# EAGLE design mirsot_sch-final (EAGLE 9.6.2)
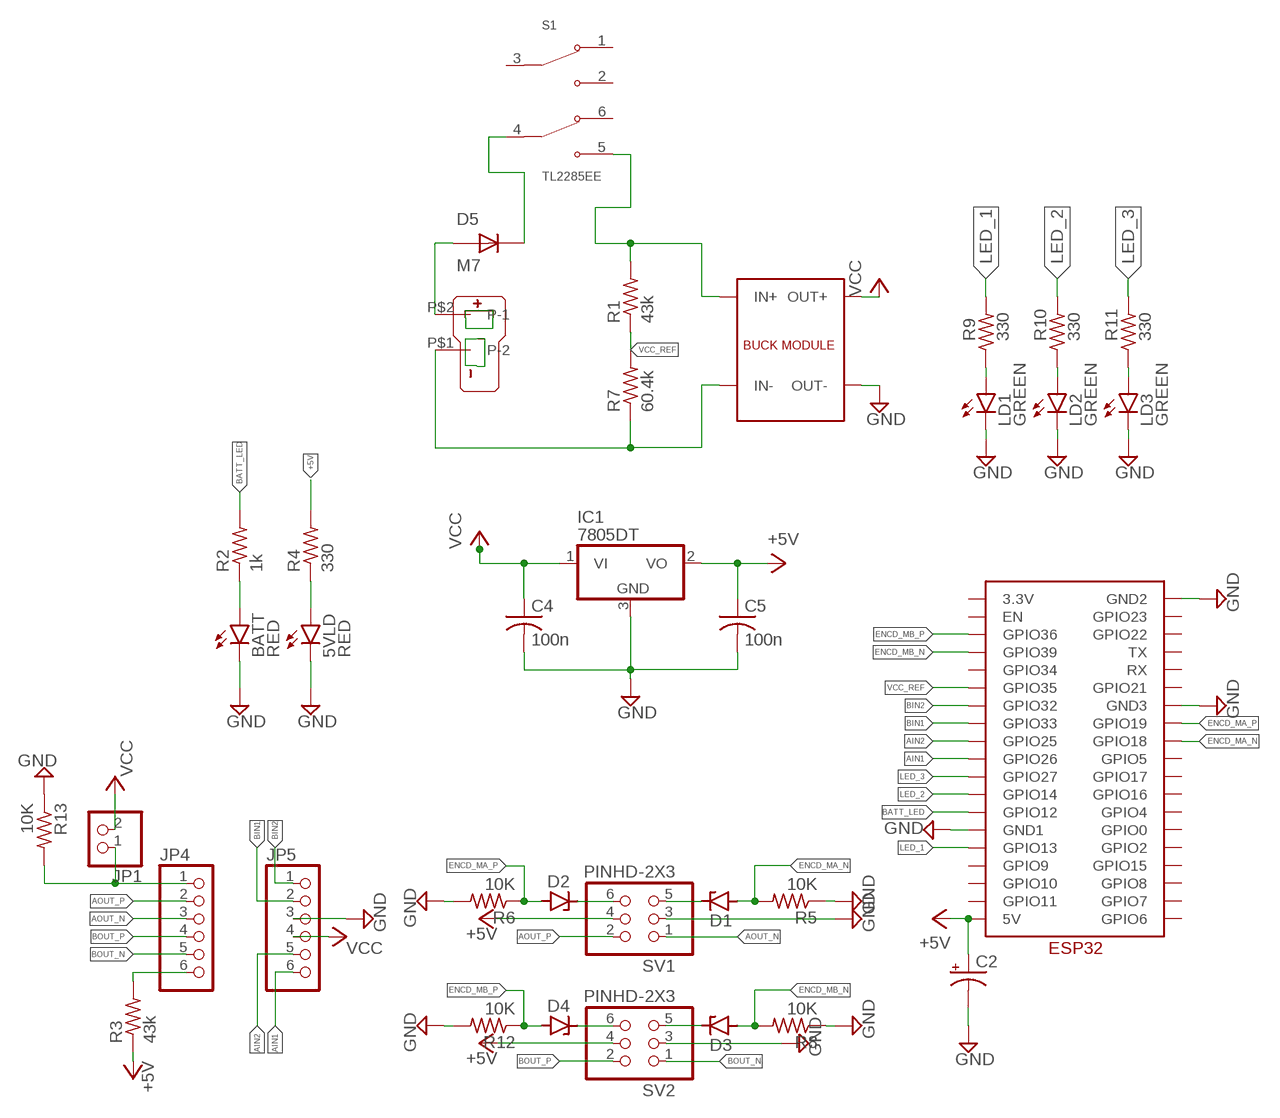
[diagram p0: schematic, sheet 1]

## Parts
5VLD  RED  LEDSML1206  [SML1206]
BATT  RED  LEDSML1206  [SML1206]
C2  CPOL-USE2.5-6  [E2,5-6]
C4  100n  C-USC0603K  [C0603K]
C5  100n  C-USC0603K  [C0603K]
D1  ZENER-DIODEDO34-7  [DO34Z7]
D2  ZENER-DIODEDO34-7  [DO34Z7]
D3  ZENER-DIODEDO34-7  [DO34Z7]
D4  ZENER-DIODEDO34-7  [DO34Z7]
D5  M7  [DIOM505270X240]
IC1  7805DT  [TO252]
JP1  PINHD-1X2  [1X02]
JP4  PINHD-1X6  [1X06]
JP5  PINHD-1X6  [1X06]
LD1  GREEN  LEDSML1206  [SML1206]
LD2  GREEN  LEDSML1206  [SML1206]
LD3  GREEN  LEDSML1206  [SML1206]
R1  43k  R-US_M1206  [M1206]
R2  1k  R-US_M1206  [M1206]
R3  43k  R-US_M1206  [M1206]
R4  330  R-US_M1206  [M1206]
R5  10K  R-US_M1206  [M1206]
R6  10K  R-US_M1206  [M1206]
R7  60.4k  R-US_M1206  [M1206]
R8  10K  R-US_M1206  [M1206]
R9  330  R-US_M1206  [M1206]
R10  330  R-US_M1206  [M1206]
R11  330  R-US_M1206  [M1206]
R12  10K  R-US_M1206  [M1206]
R13  10K  R-US_M1206  [M1206]
S1  TL2285EE  [SW_TL2285EE]
SV1  PINHD-2X3  [2X03]
SV2  PINHD-2X3  [2X03]
U$1  T_PLUG_CONNECTOR_H  [T_PLUG_CONNECTOR_H]
U$2  ESP32  [ESP32]
U$3  BUCK_CONVERTER  [BUCK_CONVERTER]

## Nets
+5V: C2.+ C5.1 IC1.2(VO) R3.1 R4.2 SV1.4 SV2.4 U$2.5V
AIN1 [signal]: JP5.6 U$2.GPIO26
AIN2 [signal]: JP5.5 U$2.GPIO25
AOUT_N: JP4.3 SV1.1
AOUT_P: JP4.2 SV1.2
BATT_LED [signal]: R2.2 U$2.GPIO12
BIN1 [signal]: JP5.2 U$2.GPIO33
BIN2 [signal]: JP5.1 U$2.GPIO32
BOUT_N [power]: JP4.5 SV2.1
BOUT_P [power]: JP4.4 SV2.2
ENCD_MA_N [signal]: D1.A R5.2 U$2.GPIO18
ENCD_MA_P [signal]: D2.A R6.1 U$2.GPIO19
ENCD_MB_N [signal]: D3.A R8.2 U$2.GPIO39
ENCD_MB_P [signal]: D4.A R12.1 U$2.GPIO36
GND [power]: 5VLD.C BATT.C C2.- C4.2 C5.2 IC1.3(GND) JP5.3 LD1.C LD2.C LD3.C R5.1 R6.2 R8.1 R12.2 R13.1 SV1.3 SV2.3 U$2.GND1 U$2.GND2 U$2.GND3 U$3.OUT-
LED_1 [signal]: R9.2 U$2.GPIO13
LED_2 [signal]: R10.2 U$2.GPIO14
LED_3 [signal]: R11.2 U$2.GPIO27
N$1 [signal]: JP4.6 R3.2
N$2 [signal]: BATT.A R2.1
N$3 [signal]: LD1.A R9.1
N$4 [signal]: LD2.A R10.1
N$5 [signal]: 5VLD.A R4.1
N$6: D1.C SV1.5
N$7: D2.C SV1.6
N$8: D3.C SV2.5
N$9 [signal]: LD3.A R11.1
N$10: D4.C SV2.6
N$11 [power]: D5.A U$1.P$2(P-1)
N$13: JP1.1 JP4.1 R13.2
N$14: D5.C S1.4(COM2)
N$15 [power]: R1.2 S1.5(NO2) U$3.IN+
N$16 [power]: R7.1 U$1.P$1(P-2) U$3.IN-
VCC [power]: C4.1 IC1.1(VI) JP1.2 JP5.4 U$3.OUT+
VCC_REF [signal]: R1.1 R7.2 U$2.GPIO35
Unconnected: S1.1(NC1) S1.2(NO1) S1.3(COM1) S1.6(NC2) U$2.3.3V U$2.EN U$2.GPIO0 U$2.GPIO2 U$2.GPIO4 U$2.GPIO5 U$2.GPIO6 U$2.GPIO7 U$2.GPIO8 U$2.GPIO9 U$2.GPIO10 U$2.GPIO11 U$2.GPIO15 U$2.GPIO16 U$2.GPIO17 U$2.GPIO21 U$2.GPIO22 U$2.GPIO23 U$2.GPIO34 U$2.RX U$2.TX

## Library data of the parts
5VLD BATT LD1-LD3 = led:LED: LED OSRAM: - CHIPLED LG R971, LG N971, LY N971, LG Q971, LY Q971, LO R971, LY R971 LH N974, LH R974 LS Q976, LO Q976, LY Q976 LO Q996 - Hyper CHIPLED LW Q18S LB Q993, LB Q99A, LB R99A - SideLED LS A670, LO A670, LY A670, LG A670, LP A670 LB A673, LV A673, LT A673, LW A673 LH A674 LY A675 LS A676, LA A676, LO A676, LY A676, LW A676 LS A679, LY A679, LG A679 - Hyper Micro SIDELED® LS Y876, LA Y876, LO Y876, LY Y876 LT Y87S - SmartLED LW L88C, LW L88S LB L89C, LB L89S, LG L890 LS L89K, LO L89K, LY L89K LS L896, LA L896, LO L896, LY L896 - TOPLED LS T670, LO T670, LY T670, LG T670, LP T670 LSG T670, LSP T670, LSY T670, LOP T670, LYG T670 LG T671, LOG T671, LSG T671 LB T673, LV T673, LT T673, LW T673 LH T674 LS T676, LA T676, LO T676, LY T676, LB T676, LH T676, LSB T676, LW T676 LB T67C, LV T67C, LT T67C, LS T67K, LO T67K, LY T67K, LW E67C LS E67B, LA E67B, LO E67B, LY E67B, LB E67C, LV E67C, LT E67C LW T67C LS T679, LY T679, LG T679 LS T770, LO T770, LY T770, LG T770, LP T770 LB T773, LV T773, LT T773, LW T773 LH T774 LS E675, LA E675, LY E675, LS T675 LS T776, LA T776, LO T776, LY T776, LB T776 LHGB T686 LT T68C, LB T68C - Hyper Mini TOPLED® LB M676 - Mini TOPLED Santana® LG M470 LS M47K, LO M47K, LY M47K Source: http://www.osram.convergy.de LUXEON: - LUMILED® LXK2-PW12-R00, LXK2-PW12-S00, LXK2-PW14-U00, LXK2-PW14-V00 LXK2-PM12-R00, LXK2-PM12-S00, LXK2-PM14-U00 LXK2-PE12-Q00, LXK2-PE12-R00, LXK2-PE12-S00, LXK2-PE14-T00, LXK2-PE14-U00 LXK2-PB12-K00, LXK2-PB12-L00, LXK2-PB12-M00, LXK2-PB14-N00, LXK2-PB14-P00, LXK2-PB14-Q00 LXK2-PR12-L00, LXK2-PR12-M00, LXK2-PR14-Q00, LXK2-PR14-R00 LXK2-PD12-Q00, LXK2-PD12-R00, LXK2-PD12-S00 LXK2-PH12-R00, LXK2-PH12-S00 LXK2-PL12-P00, LXK2-PL12-Q00, LXK2-PL12-R00 Source: www.luxeon.com KINGBRIGHT: KA-3528ASYC Source: www.kingbright.com
C2 = rcl:CPOL-US: POLARIZED CAPACITOR, American symbol; SPICEPREFIX: C
C4 C5 = rcl:C-US: CAPACITOR, American symbol; SPICEPREFIX: C
D1-D4 = diode:ZENER-DIODE: Z-Diode
D5 = M7:M7: none Check availability <https://pricing.snapeda.com/parts/M7/Diotec%20Semiconductor/view-part?ref=eda>; AVAILABILITY: In Stock; DESCRIPTION: Diode Standard 1000 V 1A Surface Mount DO-214AC (SMA); MF: Diotec Semiconductor; MP: M7; PACKAGE: DO-214AC-2 Diotec; PRICE: None; PURCHASE-URL: https://pricing.snapeda.com/search/part/M7/?ref=eda
IC1 = linear:78*: Positive VOLTAGE REGULATOR Source: http://cache.national.com/ds/LM/LM78L05.pdf http://www.fairchildsemi.com/ds/LM/LM7805.pdf
JP1 = pinhead:PINHD-1X2: PIN HEADER
JP4 JP5 = pinhead:PINHD-1X6: PIN HEADER
R1-R13 = rcl:R-US_: RESISTOR, American symbol; SPICEPREFIX: R
S1 = TL2285EE:TL2285EE: Check availability <https://pricing.snapeda.com/parts/TL2285EE/E-Switch/view-part?ref=eda>; AVAILABILITY: In Stock; CHECK_PRICES: https://www.snapeda.com/parts/TL2285EE/E-Switch/view-part/?ref=eda; DESCRIPTION: Pushbutton Switch DPDT Standard Through Hole; MF: E-Switch; MP: TL2285EE; PACKAGE: None; PRICE: None; PURCHASE-URL: https://www.snapeda.com/api/url_track_click_mouser/?unipart_id=653295&manufacturer=E-Switch&part_name=TL2285EE&search_term=None; SNAPEDA_LINK: https://www.snapeda.com/parts/TL2285EE/E-Switch/view-part/?ref=snap
SV1 SV2 = Connector:PINHD-2X3: PIN HEADER; CATEGORY: CONNECTOR; SUB-CATEGORY: PIN-HEADER
U$1 = con-T-plug:T_PLUG_CONNECTOR_H
U$2 = ESP32:ESP32
U$3 = BUCK_CONVERTER:BUCK_CONVERTER

## Net classes
1 power: width 0.762 mm, drill 0.75 mm, clearance 0.508 mm
2 signal: width 0.381 mm, drill 0.005 mm, clearance 0.508 mm

## Board
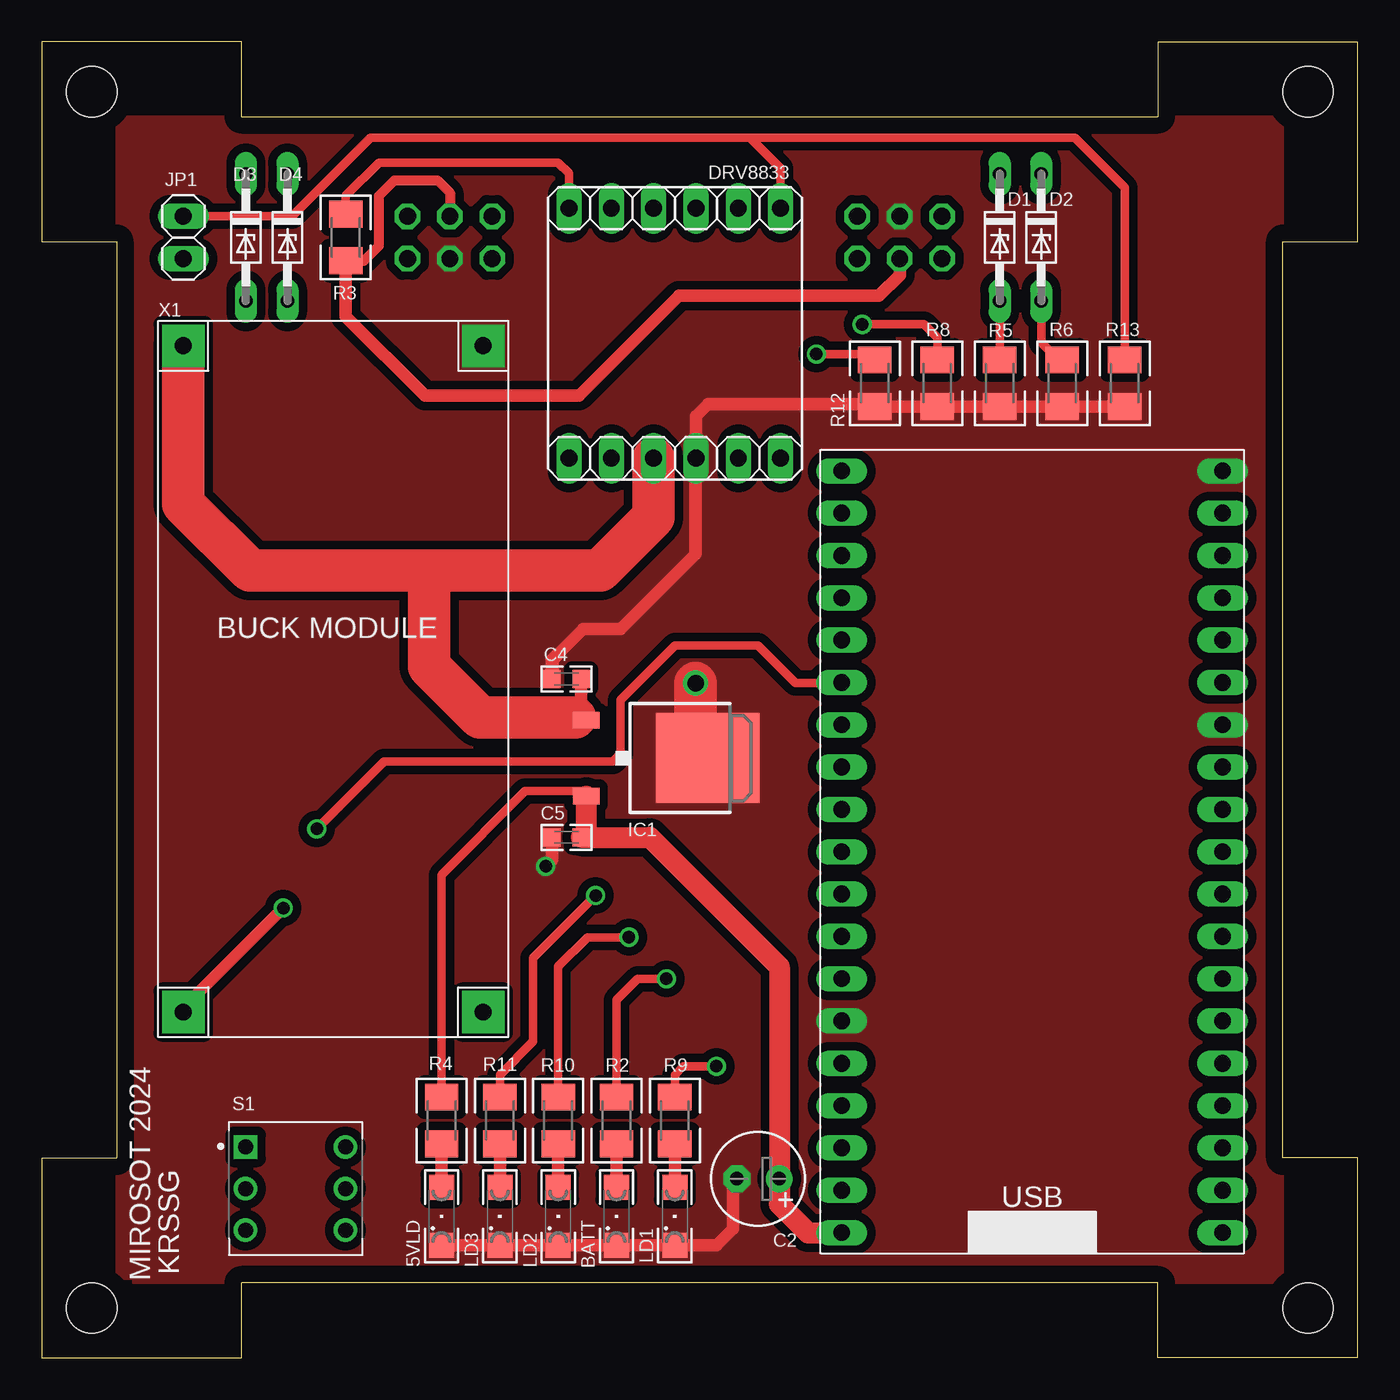
[diagram p1: board, top side]
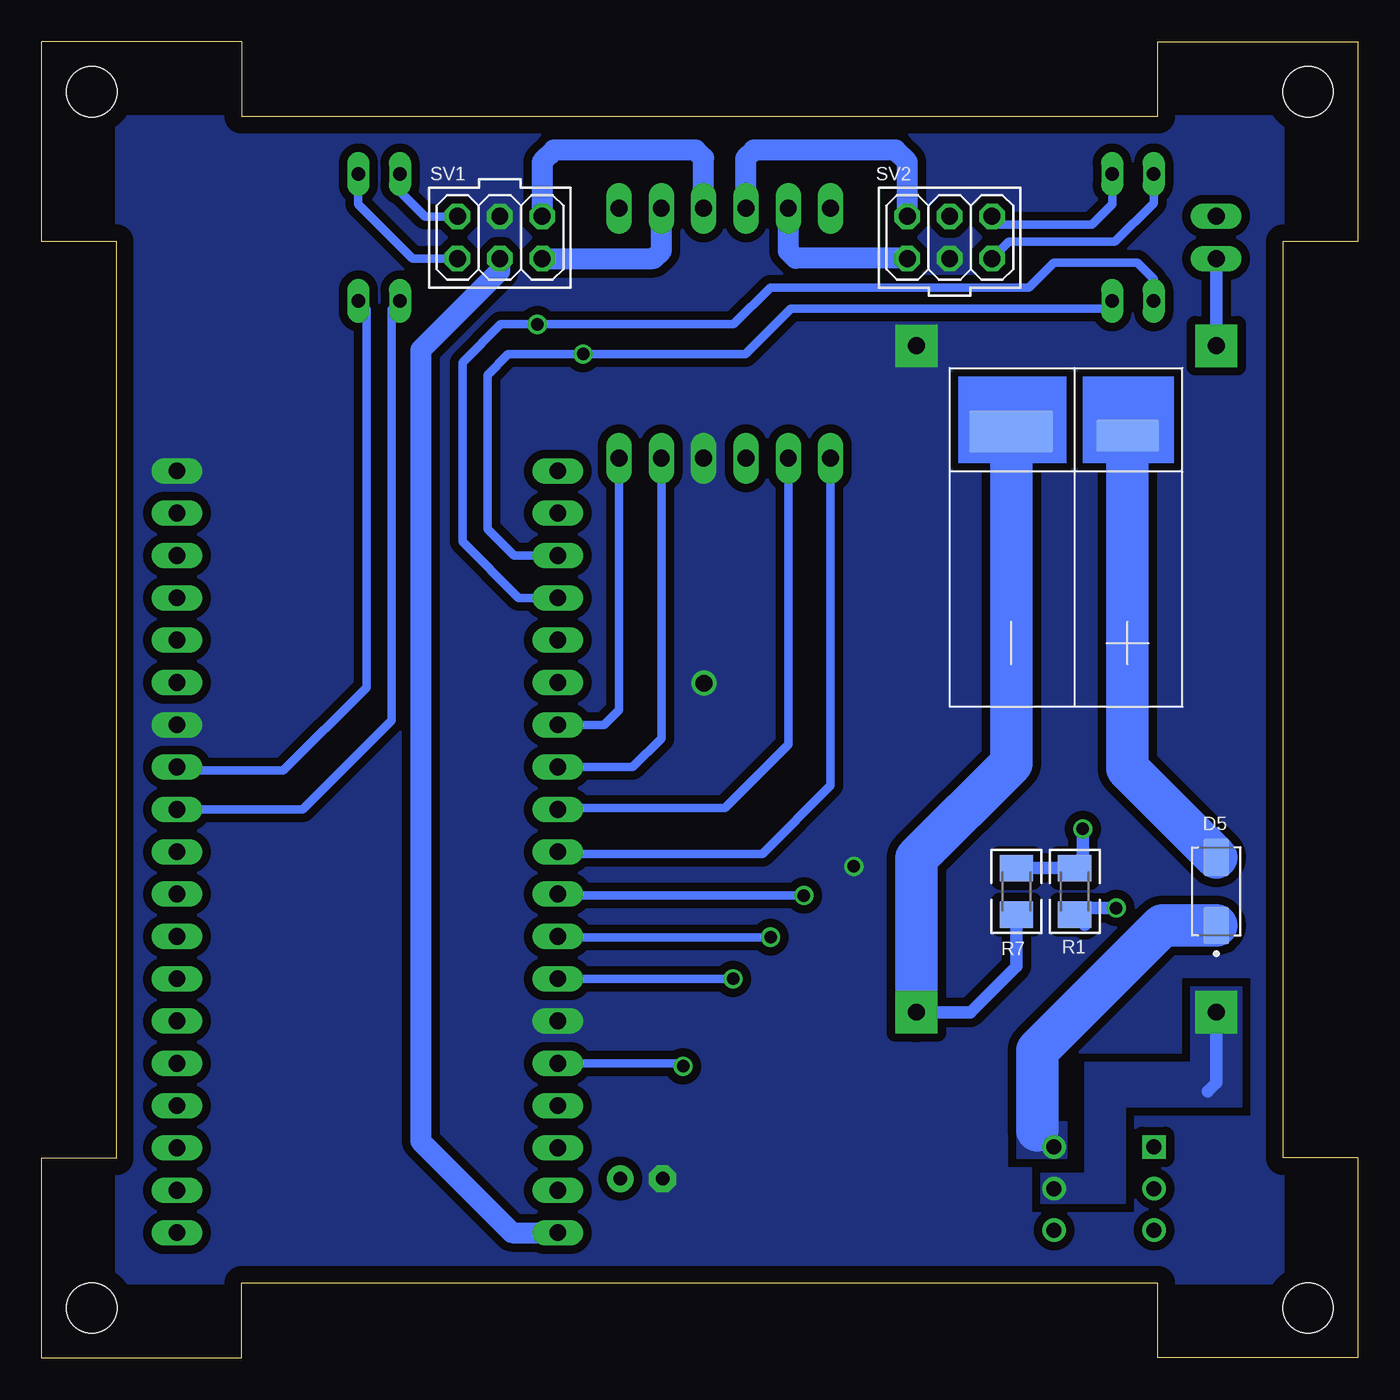
[diagram p2: board, bottom side, seen from below]

Size 79 x 79 mm. Coordinates in mm from the lower left corner, seen from the top.
Outline: 79,0 79,12 74.5,12 74.5,67 79,67 79,79 67,79 67,74.5 12,74.5 12,79 0,79 0,67 4.5,67 4.5,12 0,12 0,0 12,0 12,4.5 67,4.5 67,0 79,0
Copper layers (1*16): Top 0.035mm / dielectric 1.5mm / Bottom 0.035mm
Design rules "default": minimum track width 6mil, minimum drill 0.35mm, track to track 6mil, track to pad 6mil, pad to pad 6mil, via to via 6mil, smd to smd 6mil, copper to edge 40mil, drill to drill 6mil, minimum pad ring 10mil, minimum via ring 8mil, stop-mask expansion 4mil, vias tented up to drill 0mil, thermal gap 10mil
Holes 3 mm at 3,76 3,3 76,3 76,76

### Footprints (pad centres in the part's own frame; a part is rotated, then mirrored left to right if it is on the bottom)
SML1206 = smd 1.5 x 1.5: A 1.75,0; C -1.75,0
E2,5-6 = drill 0.813 pad 1.6: + -1.27,0 | drill 0.813 pad 1.6 octagon: - 1.27,0
C0603K = smd 1.05 x 1.08: 1 -0.875,0; 2 0.875,0
DO34Z7 = drill 0.813 long: A 3.81,0; C -3.81,0
DIOM505270X240 = smd 2.21 x 1.53: A 2.05,0; C -2.05,0
TO252 = smd 1 x 1.6: 1 -2.28,-4.8; 2 2.28,-4.8 | smd 5.4 x 6.2: 3 0,2.5
1X02 = drill 1.016 long: 1 -1.27,0; 2 1.27,0
1X06 = drill 1.016 long: 1 -6.35,0; 2 -3.81,0; 3 -1.27,0; 4 1.27,0; 5 3.81,0; 6 6.35,0
M1206 = smd 1.6 x 2: 1 -1.4,0; 2 1.4,0
SW_TL2285EE = drill 0.9 square: 1 -2.5,-3 | drill 0.9: 2 0,-3; 3 2.5,-3; 4 -2.5,3; 5 0,3; 6 2.5,3
2X03 = drill 1.016 octagon: 1 -2.54,-1.27; 2 -2.54,1.27; 3 0,-1.27; 4 0,1.27; 5 2.54,-1.27; 6 2.54,1.27
T_PLUG_CONNECTOR_H = smd 2.54 x 5.08: P$1 6.35,3.81 | smd 1.93 x 3.81: P$2 6.096,-3.175
ESP32 = drill 1.016 long: 3.3V 1.27,46.99; 5V 1.27,1.27; EN 1.27,44.45; GND1 1.27,13.97; GND2 24.13,46.99; GND3 24.13,31.75; GPIO0 24.13,13.97; GPIO2 24.13,11.43; GPIO4 24.13,16.51; GPIO5 24.13,24.13; GPIO6 24.13,1.27; GPIO7 24.13,3.81; GPIO8 24.13,6.35; GPIO9 1.27,8.89; GPIO10 1.27,6.35; GPIO11 1.27,3.81; GPIO12 1.27,16.51; GPIO13 1.27,11.43; GPIO14 1.27,19.05; GPIO15 24.13,8.89; GPIO16 24.13,19.05; GPIO17 24.13,21.59; GPIO18 24.13,26.67; GPIO19 24.13,29.21; GPIO21 24.13,34.29; GPIO22 24.13,41.91; GPIO23 24.13,44.45; GPIO25 1.27,26.67; GPIO26 1.27,24.13; GPIO27 1.27,21.59; GPIO32 1.27,31.75; GPIO33 1.27,29.21; GPIO34 1.27,36.83; GPIO35 1.27,34.29; GPIO36 1.27,41.91; GPIO39 1.27,39.37; RX 24.13,36.83; TX 24.13,39.37
BUCK_CONVERTER = drill 1.016 pad 2.54 square: IN+ 1.5,-41.5; IN- 19.5,-41.5; OUT+ 1.5,-1.5; OUT- 19.5,-1.5

### Placement (x,y rotation side)
5VLD  24,8.5 90 top
BATT  34.5,8.5 90 top
C2  43,10.75 180 top
C4  31.5,40.75 180 top
C5  31.5,31.25 180 top
D1  57.5,67.25 270 top
D2  60,67.25 270 top
D3  12.25,67.25 270 top
D4  14.75,67.25 270 top
D5  8.5,28 90 bottom
IC1  37.48,36 270 top
JP1  8.5,67.25 270 top
JP4  38,69 180 top
JP5  38,54 180 top
LD1  38,8.5 90 top
LD2  31,8.5 90 top
LD3  27.5,8.5 90 top
R1  17,28 270 bottom
R2  34.5,14.25 90 top
R3  18.25,67.25 90 top
R4  24,14.25 90 top
R5  57.5,58.5 90 top
R6  61.25,58.5 270 top
R7  20.5,28 90 bottom
R8  53.75,58.5 90 top
R9  38,14.25 90 top
R10  31,14.25 90 top
R11  27.5,14.25 90 top
R12  50,58.5 270 top
R13  65,58.5 90 top
S1  15.24,10.16 270 top
SV1  51.5,67.25 180 bottom
SV2  24.5,67.25 0 bottom
U$1  17,49.25 90 bottom
U$2  46.75,6.25 0 top
U$3  7,62.25 0 top

### Tracks (layer width: path | path; a pad name or v marks a point on that pad's centre or on a via)
+5V
  Top 0.508: R4.2 24,29 29.02,34.02 32.38,34.02 IC1.2
  Top 0.61: R3.1 19.35,65.85 20.25,66.75 20.25,69.75 21.18,70.68 23.75,70.68 24.5,69.93 SV2.4
  Top 0.762: R3.1 18.25,62.5 23,57.75 32.25,57.75 38.25,63.75 50.25,63.75 51.5,65 SV1.4
  Top 1.27: IC1.2 32.68,31.55 C5.1 36.5,31.25 44.27,23.48 C2.+ 44.27,9.23 46,7.5 48,7.5 U$2.5V
  Bottom 0.61: SV1.4 51.5,65.73
  Bottom 1.016: 56.1,12.85 50.77,7.52
  Bottom 1.27: U$2.5V 50.77,7.52 56.25,13 56.25,60.5 51.5,65.25 SV1.4
AIN1
  Bottom 0.508: JP5.6 31.65,35 31.65,34.35 35.75,30.25 47.89,30.25 U$2.GPIO26
AIN2
  Bottom 0.508: JP5.5 34.19,36.81 38,33 47.94,33 U$2.GPIO25
AOUT_N
  Bottom 1.27: JP4.3 39.27,72.02 39.75,72.5 48.25,72.5 48.96,71.79 SV1.1
AOUT_P
  Bottom 1.27: SV1.2 42.27,65.98 41.81,66.44 JP4.2
BATT_LED  (via drill 0.75)
  Top 0.508: R2.2 34.5,21.5 35.75,22.75 v37.5,22.75
  Bottom 0.508: v37.5,22.75 U$2.GPIO12
BIN1
  Bottom 0.508: JP5.2 41.81,37.19 43.54,35.46 U$2.GPIO33
BIN2
  Bottom 0.508: JP5.1 44.35,38.9 45.25,38 U$2.GPIO32
BOUT_N
  Bottom 0.762: SV2.1 27.06,66
  Bottom 1.27: 27.06,66 33.75,66 34.19,66.44 JP4.5
BOUT_P
  Bottom 0.762: 36.75,69.02 JP4.4
  Bottom 1.27: SV2.2 27.04,71.79 27.75,72.5 36.25,72.5 36.75,72 36.75,69.02
ENCD_MA_N
  Top 0.508: D1.A R5.2
  Bottom 0.508: D1.A 58,62.94 58,38.25 63.33,32.92 U$2.GPIO18
ENCD_MA_P
  Top 0.508: D2.A 60,60.94 61.04,59.9 R6.1
  Bottom 0.508: D2.A 59.5,62.94 59.5,40.25 64.5,35.25 70.67,35.25 U$2.GPIO19
ENCD_MB_N  (via drill 0.75)
  Top 0.406: 53.5,60.15 R8.2
  Top 0.508: 53.6,59.9 R8.2 53.75,61.25 52.96,62.04 v49.25,62.04
  Bottom 0.508: D3.A 12.25,64.75 13.25,65.75 18.25,65.75 19.75,64.25 35.25,64.25 37.46,62.04 v49.25,62.04 51.46,62.04 53.75,59.75 53.75,49 50.37,45.62 U$2.GPIO39
ENCD_MB_P  (via drill 0.75)
  Top 0.508: v46.5,60.25 49.65,60.25 R12.1
  Bottom 0.508: 14.96,63.23 D4.A 14.75,63.31 15.08,62.98 34.02,62.98 36.75,60.25 v46.5,60.25 51,60.25 52.25,59 52.25,49.75 50.66,48.16 U$2.GPIO36
GND  (via drill 0.75, 1)
  Top 0.762: 30.88,42.12 32.5,43.75 34.75,43.75 39.25,48.25 39.25,53.98 JP5.3 39.27,56.52 40,57.25 49.85,57.25 R12.2 R8.1 R5.1 R6.2 R13.1 | 39.98,33.98 IC1.3 39.02,37.27 39,37.28 | C5.2 30.62,29.88 v30.25,29.5 | 5VLD.C LD3.C LD2.C BATT.C LD1.C 40.5,6.75 41.5,7.75 41.5,10.52 C2.-
  Top 0.813: C4.2 30.62,41.88 30.88,42.12
  Top 2.54: IC1.3 39.25,37.03 | 39.02,37.27 39.25,37.5 v39.25,40.5
  pour Bottom (isolate 0.406, rank 2, no thermals): 74.5,74.5 74.5,4.5 4.5,4.5 4.5,74.5
  pour Top (no thermals): 12,74.5 74.5,74.5 74.5,4.5 5.5,4.5 5.5,4.75 4.5,4.75 4.5,74.5
LED_1  (via drill 0.75)
  Top 0.508: v40.5,17.5 38.5,17.5 38,17 R9.2
  Bottom 0.508: U$2.GPIO13 40.68,17.68 v40.5,17.5
LED_2  (via drill 0.75)
  Top 0.508: R10.2 31,23.5 32.75,25.25 v35.25,25.25
  Bottom 0.508: U$2.GPIO14 47.97,25.25 v35.25,25.25
LED_3  (via drill 0.75)
  Top 0.508: v33.25,27.75 29.5,24 29.5,19 27.5,17 R11.2
  Bottom 0.508: U$2.GPIO27 47.93,27.75 v33.25,27.75
N$1
  Top 0.508: JP4.6 31.65,71.1 31,71.75 20.25,71.75 18.25,69.75 R3.2
N$2
  Top 0.762: R2.1 BATT.A
N$3
  Top 0.762: R9.1 LD1.A
N$4
  Top 0.762: R10.1 LD2.A
N$5
  Top 0.762: R4.1 5VLD.A
N$6
  Bottom 0.508: D1.C 57.5,70 56,68.5 54.06,68.5 SV1.5
N$7
  Bottom 0.508: D2.C 60,69.25 56.73,65.98 SV1.6
N$8
  Bottom 0.508: D3.C 12.25,69.31 14.58,66.98 20.96,66.98 SV2.5
N$9
  Top 0.762: R11.1 LD3.A
N$10
  Bottom 0.508: 22,68.56 SV2.6 21.46,68.02 15.98,68.02 14.75,69.25 D4.C
N$11
  Bottom 2.54: U$1.P$2 13.82,35.38 D5.A
N$13
  Top 0.508: JP4.1 44.35,71.4 42.52,73.23 | JP1.1 15.02,68.52 19.73,73.23 42.52,73.23 | 42.52,73.23 62.02,73.23 65,70.25 R13.2
N$14
  Bottom 1.27: S1.4 19.24,13.66
  Bottom 2.54: D5.C 11.75,25.95 19.24,18.46 19.24,13.66
  pour Bottom (no thermals): 17.5,12 17.5,14.15 20.45,14.15 20.45,12
N$15  (via drill 0.75)
  Top 0.762: U$3.IN+ 8.5,21 v14.5,27
  Bottom 0.762: 17.25,26.35 R1.2 | R1.2 16.4,26 | v14.5,27 16.6,27 R1.2 | U$3.IN+ 8.5,16.5 9,16
  pour Bottom (no thermals): 14,11.04 19,11.04 19,9.3 14,9.3
  pour Bottom: 7,17.7 16.35,17.7 16.35,9.34 14,9.34 14,15.1 7,15.1
  pour Bottom (no thermals): 7,16 10,16 10,22.25 7,22.25
N$16
  Bottom 0.762: R7.1 20.5,23.5 23.25,20.75 U$3.IN-
  Bottom 2.54: U$1.P$1 20.81,35.69 26.5,30 U$3.IN-
VCC
  Top 0.762: IC1.1 32.62,38.63 | IC1.1 32.15,38.58 32,38.43 | C4.1 32.38,38.59 IC1.1
  Top 2.54: U$3.OUT+ 8.5,51.25 12.5,47.25 23.25,47.25 | 23.25,47.25 33.5,47.25 36.73,50.48 JP5.4 | 23.25,47.25 23.25,41.5 26.32,38.43 32,38.43
  Bottom 0.762: U$3.OUT+ JP1.2
VCC_REF  (via drill 0.75)
  Top 0.508: U$2.GPIO35 47.98,40.5 45.25,40.5 43,42.75 38,42.75 34.75,39.5 34.75,36.25 34.3,35.8 20.56,35.8 v16.51,31.75
  Bottom 0.508: 20.1,29.5 20,29.4
  Bottom 0.762: 20,29.4 R7.2 R1.1 16.51,29.89 v16.51,31.75

### Text on the board
tPlace: DRV8833
tNames: X1 | MIROSOT 2024 | KRSSG